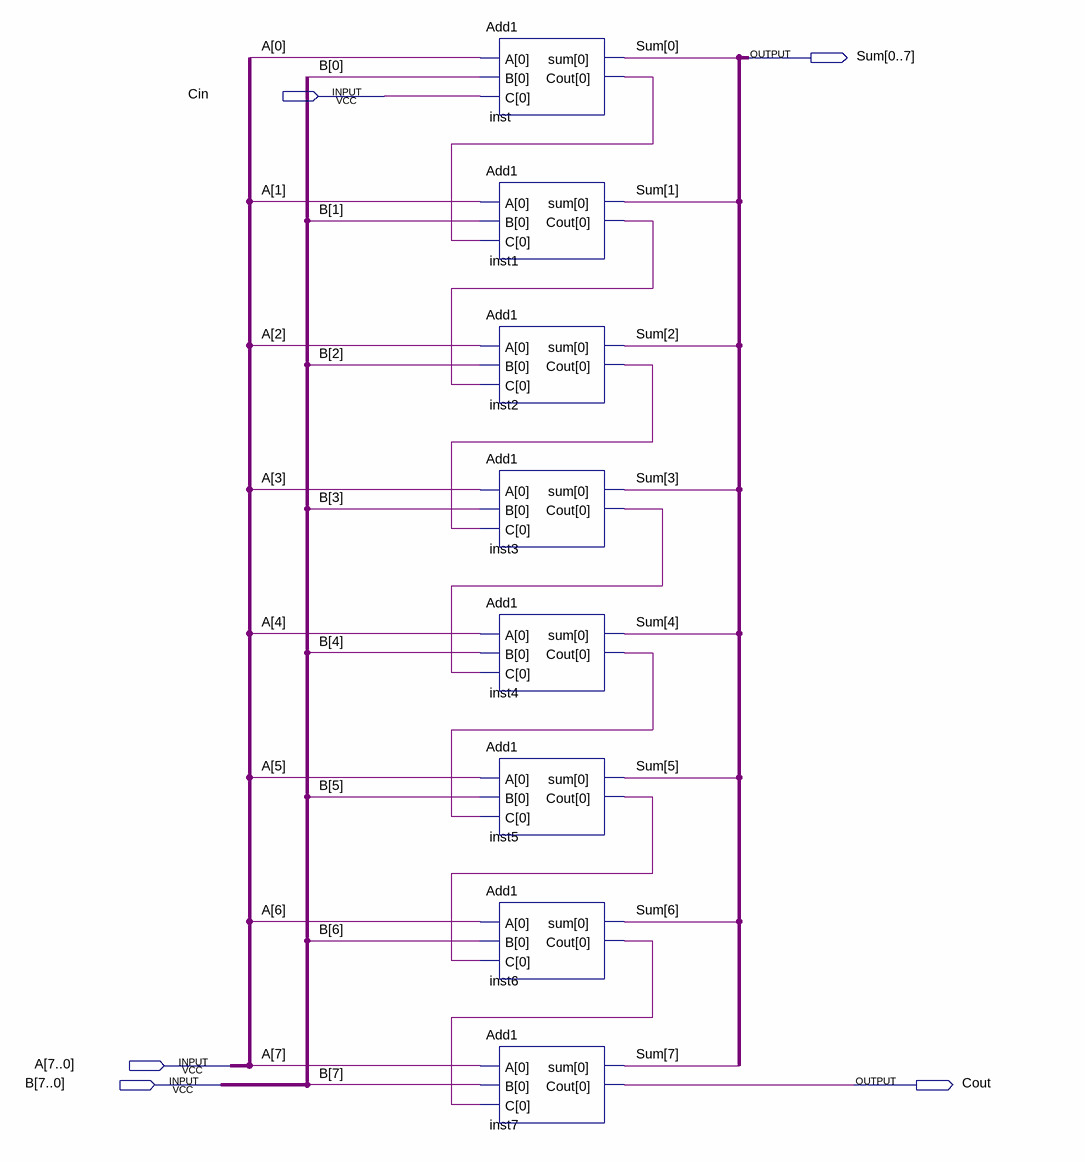
[diagram p0: schematic sheet]
// Quartus schematic Add8.bdf as structural Verilog: 8 symbols, 5 pins
module Add8 (
  input  Cin,
  input  [7:0] A,
  input  [7:0] B,
  output [0:7] Sum,
  output Cout
);

  wire inst1_cout, inst2_cout, inst3_cout, inst4_cout, inst5_cout, inst6_cout, inst_cout;

  Add1 inst (.A(A[0]), .B(B[0]), .C(Cin), .sum(Sum[0]), .Cout(inst_cout));
  Add1 inst1 (.A(A[1]), .B(B[1]), .C(inst_cout), .sum(Sum[1]), .Cout(inst1_cout));
  Add1 inst2 (.A(A[2]), .B(B[2]), .C(inst1_cout), .sum(Sum[2]), .Cout(inst2_cout));
  Add1 inst3 (.A(A[3]), .B(B[3]), .C(inst2_cout), .sum(Sum[3]), .Cout(inst3_cout));
  Add1 inst4 (.A(A[4]), .B(B[4]), .C(inst3_cout), .sum(Sum[4]), .Cout(inst4_cout));
  Add1 inst5 (.A(A[5]), .B(B[5]), .C(inst4_cout), .sum(Sum[5]), .Cout(inst5_cout));
  Add1 inst6 (.A(A[6]), .B(B[6]), .C(inst5_cout), .sum(Sum[6]), .Cout(inst6_cout));
  Add1 inst7 (.A(A[7]), .B(B[7]), .C(inst6_cout), .sum(Sum[7]), .Cout(Cout));
endmodule
